# EAGLE design the vert annotated (EAGLE 6.5.0)
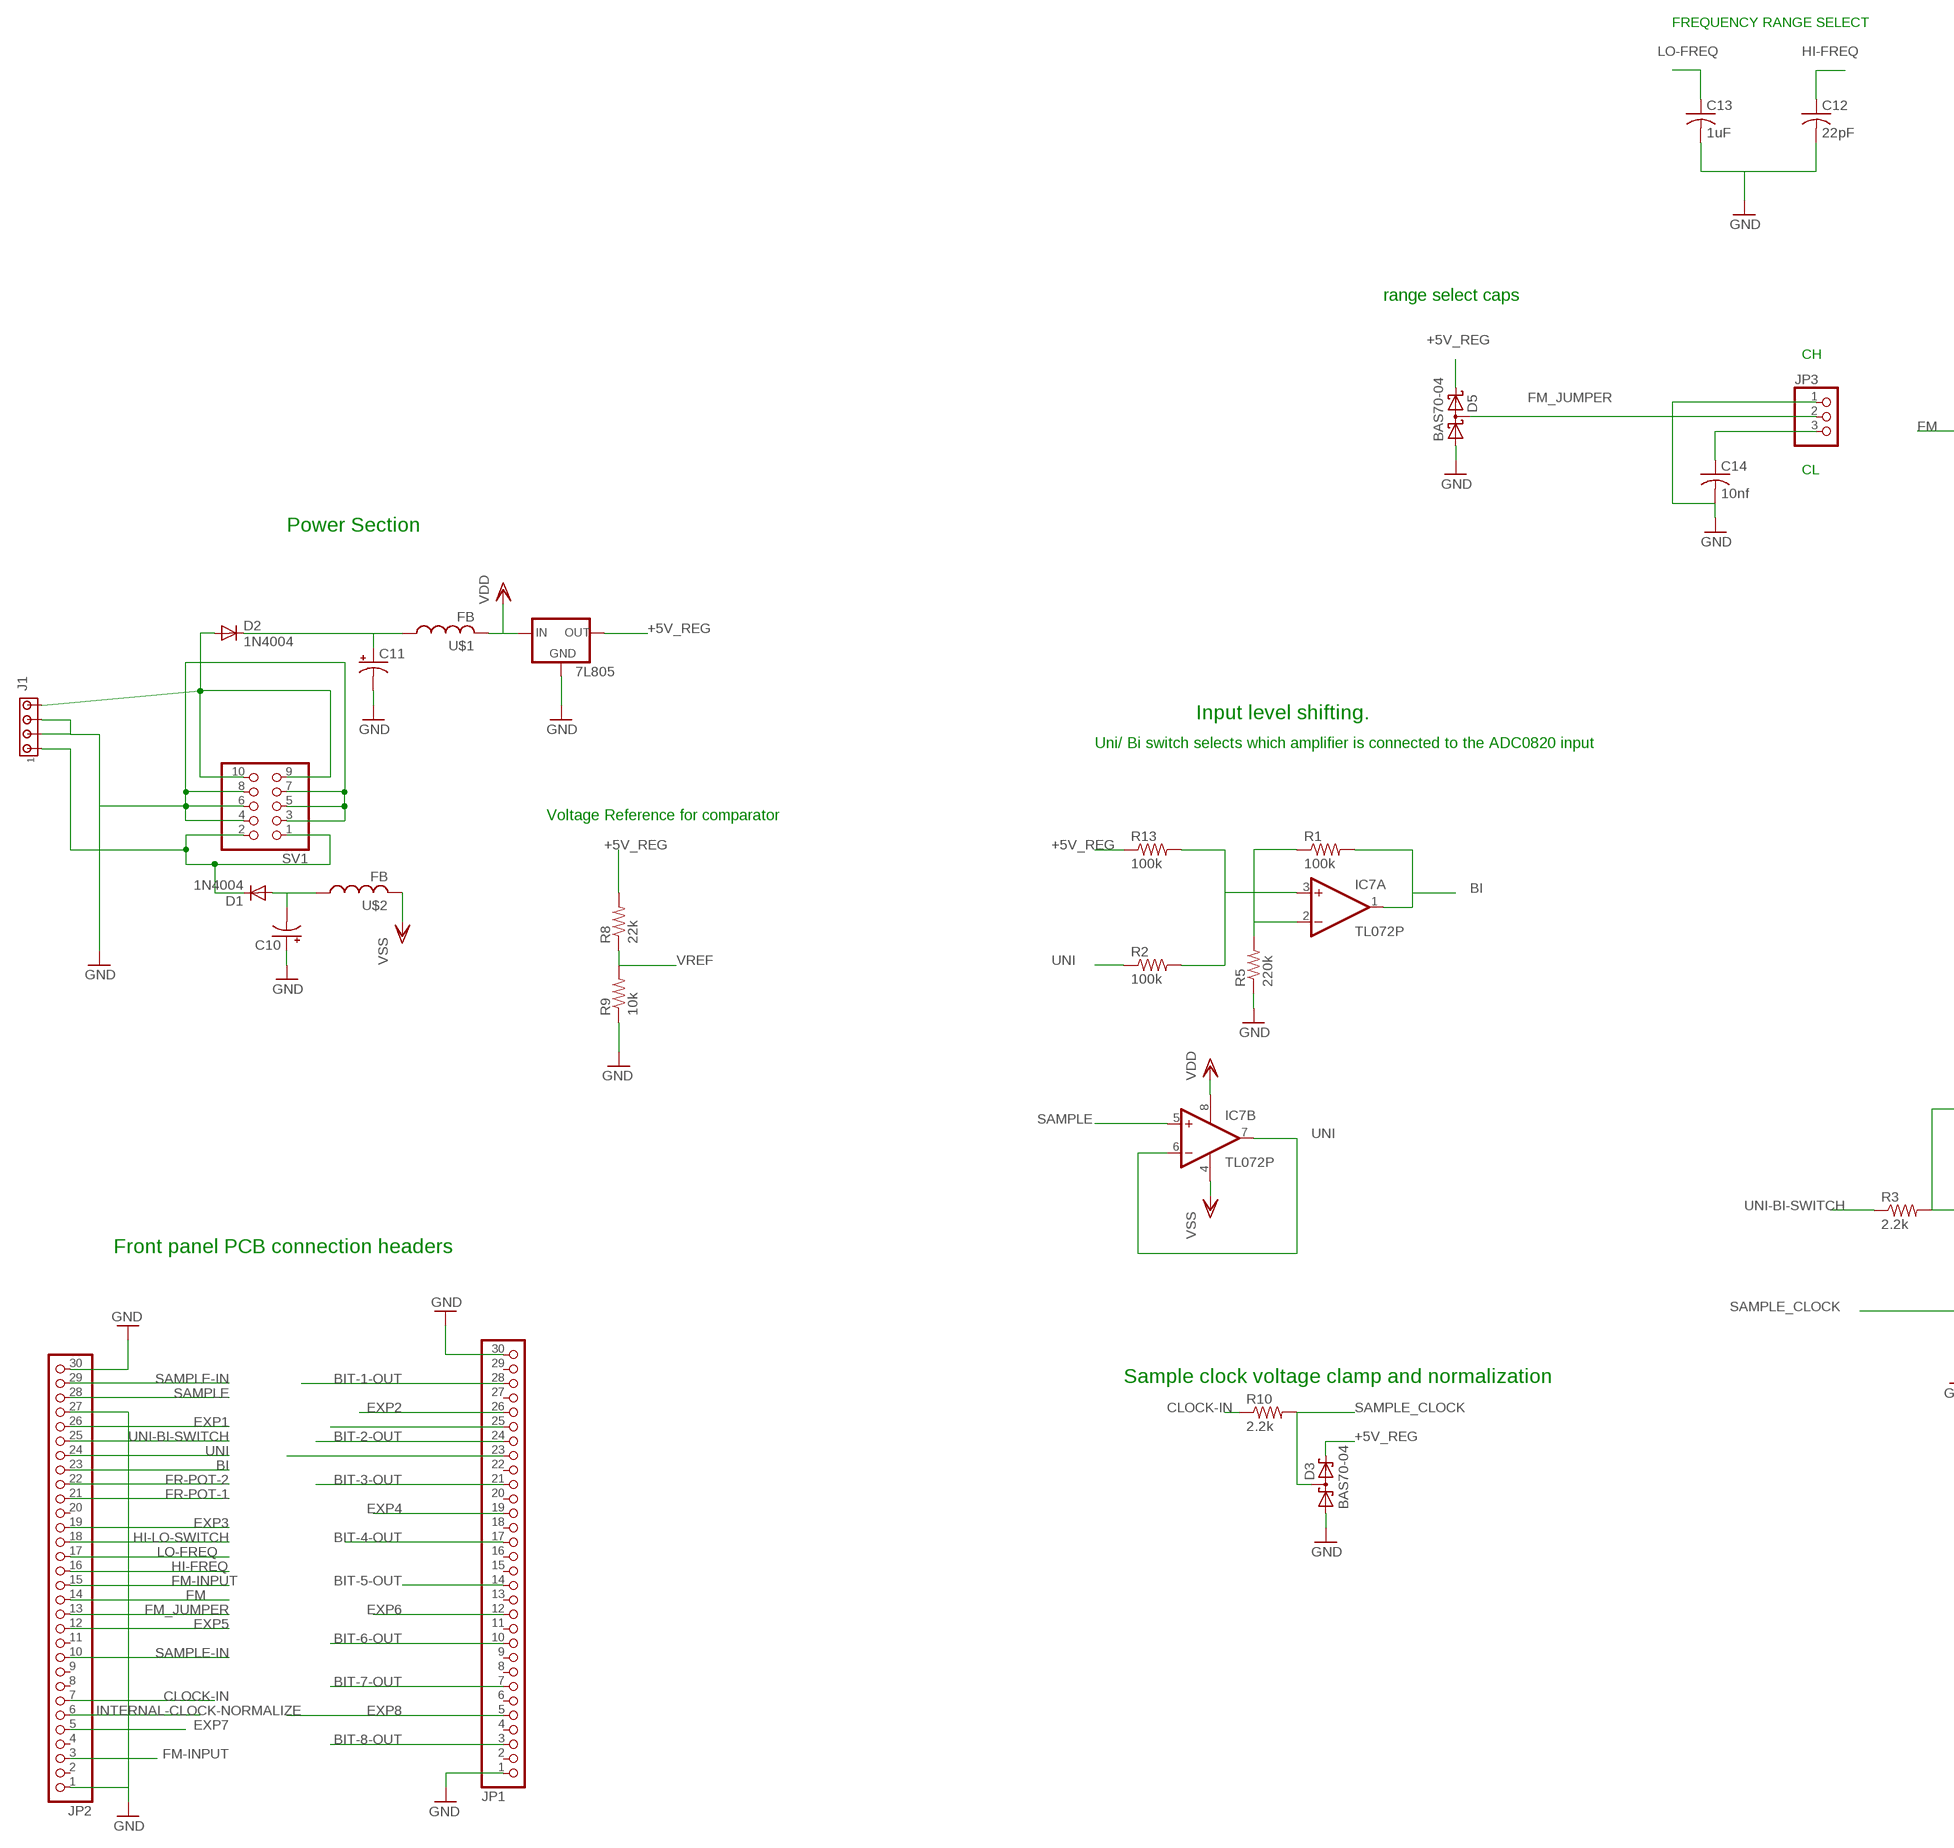
[diagram p0: schematic, sheet 1, part 1 of 2]
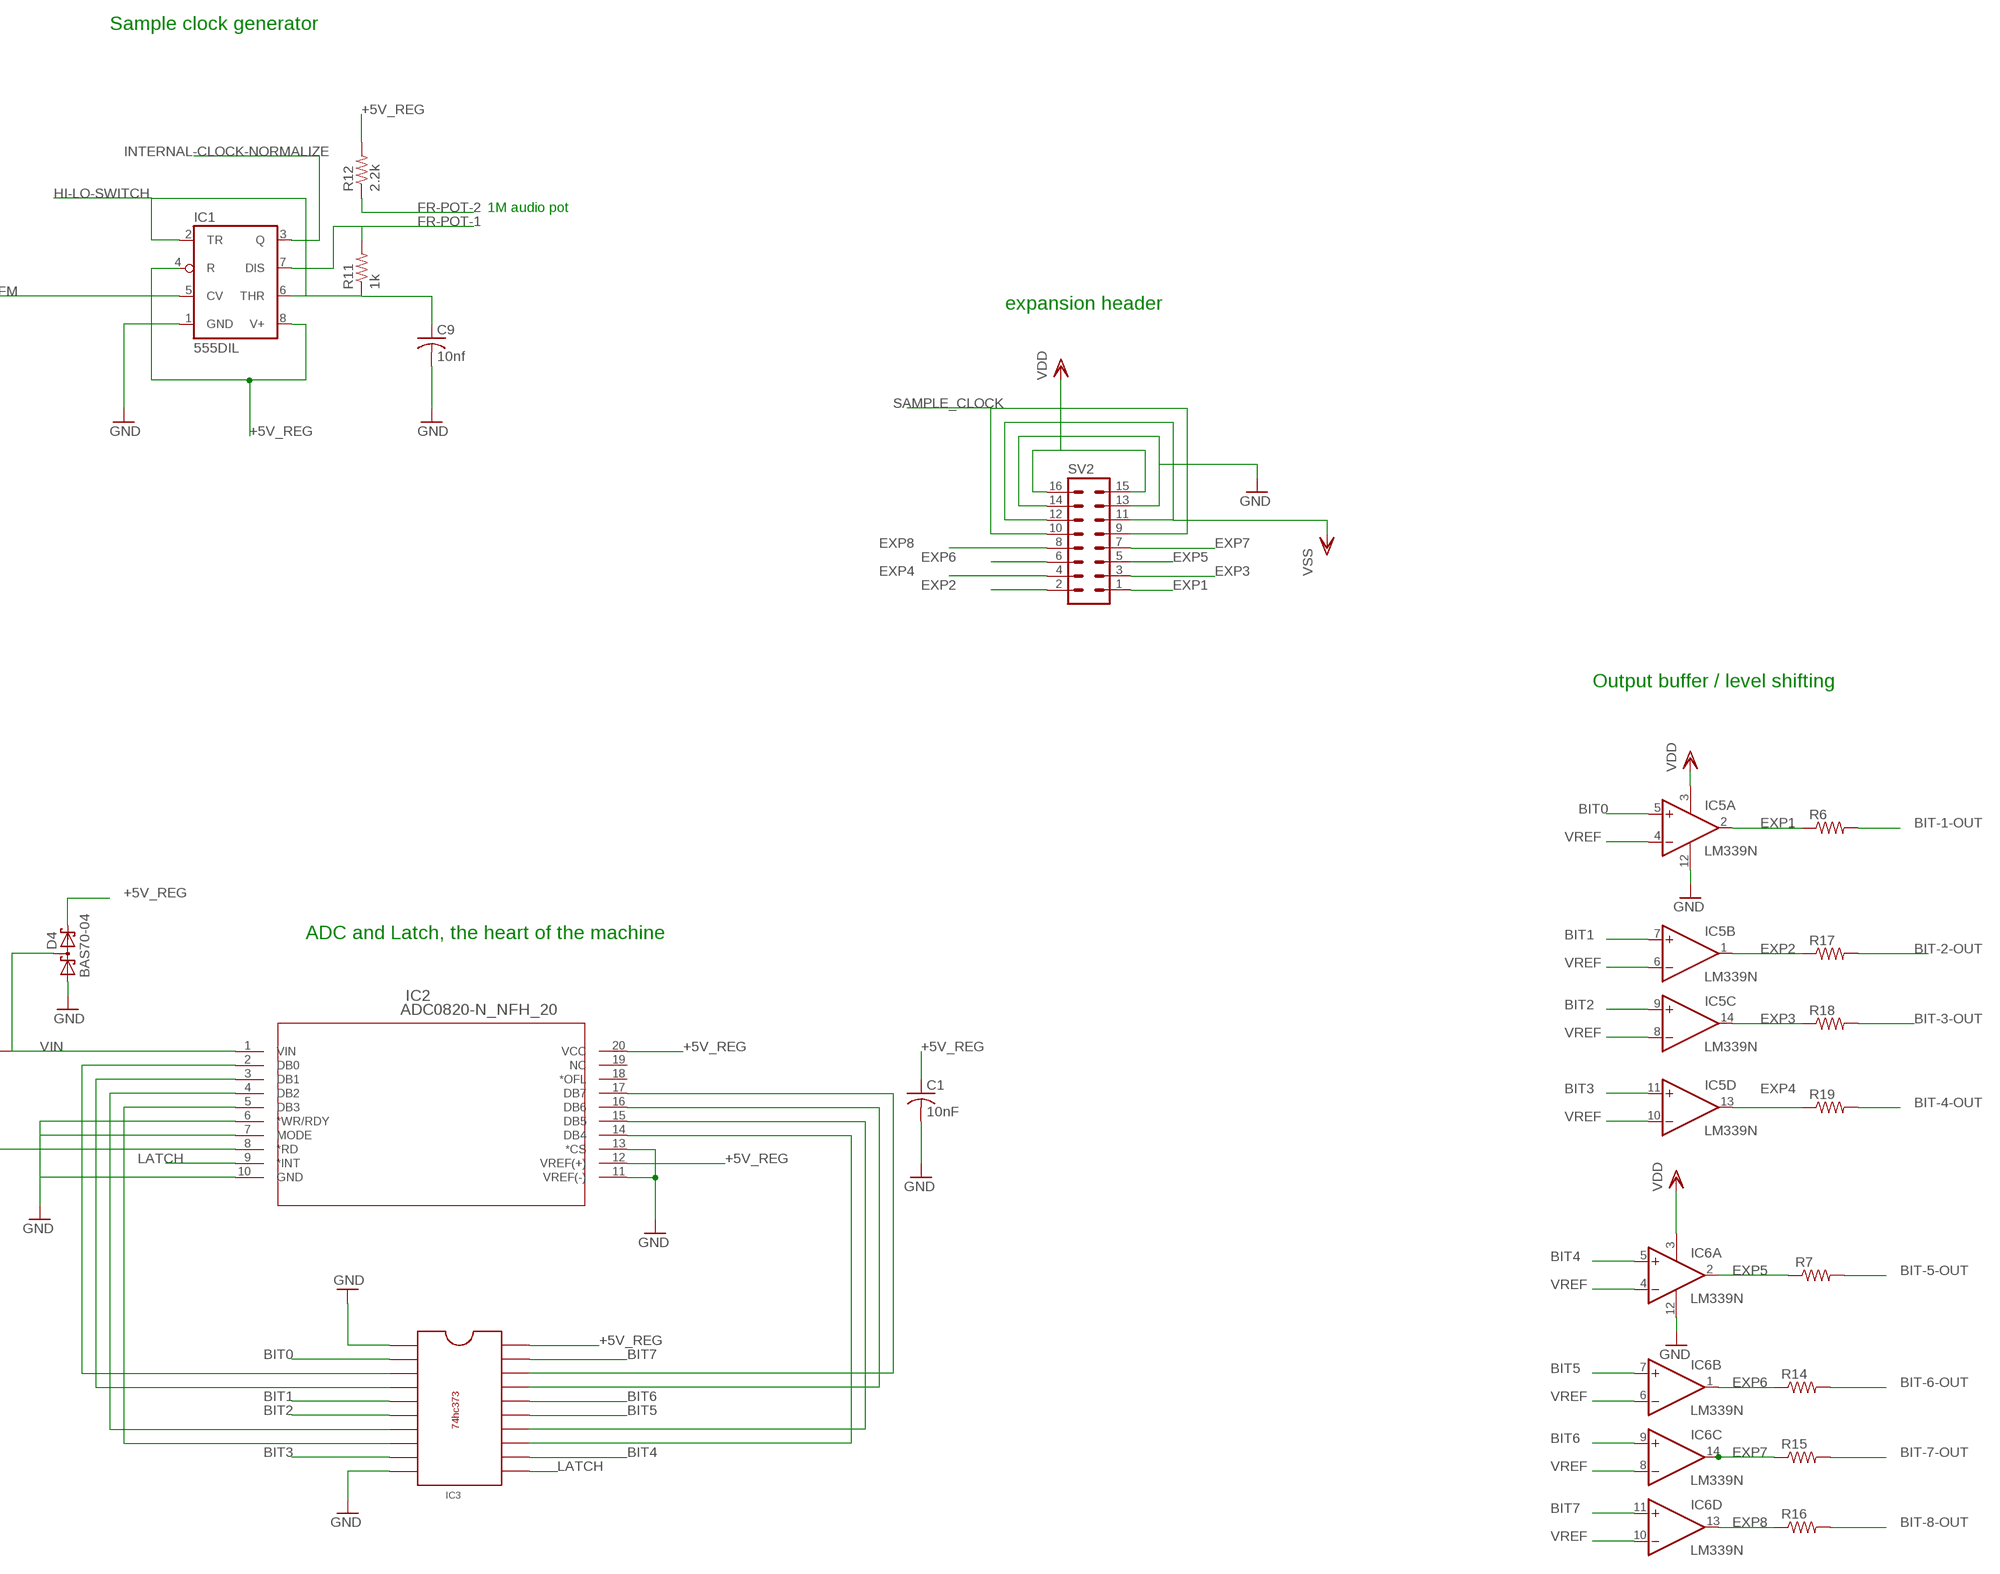
[diagram p1: schematic, sheet 1, part 2 of 2]

## Parts
7L805  78LXX  [78LXX]
C1  10nF  C-USC1206  [C1206]
C9  10nf  C-USC1206  [C1206]
C10  CPOL-USE5-5  [E5-5]
C11  CPOL-USE5-5  [E5-5]
C12  22pF  C-USC1206  [C1206]
C13  1uF  C-USC1206  [C1206]
C14  10nf  C-USC1206  [C1206]
D1  1N4004  [DO41-10]
D2  1N4004  [DO41-10]
D3  BAS70-04  [SOT23]
D4  BAS70-04  [SOT23]
D5  BAS70-04  [SOT23]
IC1  555DIL  [DIL08]
IC2  ADC0820-N_NFH_20  [NFH20]
IC3  74HC373  [DIL20]
IC5  LM339N  [DIL14]
IC6  LM339N  [DIL14]
IC7  TL072P  [DIL08]
J1  MTA04-156  [1X4MTA]
JP1  PINHD-1X30  [1X30]
JP2  PINHD-1X30  [1X30]
JP3  PINHD-1X3  [1X03]
R1  100k  R-US_R1206  [R1206]
R2  100k  R-US_R1206  [R1206]
R3  2.2k  R-US_R1206  [R1206]
R5  220k  R-US_R1206  [R1206]
R6  R-US_R1206  [R1206]
R7  R-US_R1206  [R1206]
R8  22k  R-US_R1206  [R1206]
R9  10k  R-US_R1206  [R1206]
R10  2.2k  R-US_R1206  [R1206]
R11  1k  R-US_R1206  [R1206]
R12  2.2k  R-US_R1206  [R1206]
R13  100k  R-US_R1206  [R1206]
R14  R-US_R1206  [R1206]
R15  R-US_R1206  [R1206]
R16  R-US_R1206  [R1206]
R17  R-US_R1206  [R1206]
R18  R-US_R1206  [R1206]
R19  R-US_R1206  [R1206]
SV1  PINHD-2X5  [2X05]
SV2  MA08-2  [MA08-2]
U$1  FB  [FB]
U$2  FB  [FB]

## Nets
+5V_REG: 7L805.OUT C1.1 D3.2(C2) D4.2(C2) D5.2(C2) IC1.4(R) IC1.8(V+) IC2.12(VREF(+)) IC2.20(VCC) IC3.20 R8.2 R12.2 R13.1
BI: IC7.1(A:OUT) JP2.23 R1.2
BIT0: IC3.2 IC5.5(A:+IN)
BIT1: IC3.5 IC5.7(B:+IN)
BIT2: IC3.6 IC5.9(C:+IN)
BIT3: IC3.9 IC5.11(D:+IN)
BIT4: IC3.12 IC6.5(A:+IN)
BIT5: IC3.15 IC6.7(B:+IN)
BIT6: IC3.16 IC6.9(C:+IN)
BIT7: IC3.19 IC6.11(D:+IN)
BIT-1-OUT: JP1.28 R6.2
BIT-2-OUT: JP1.24 R17.2
BIT-3-OUT: JP1.21 R18.2
BIT-4-OUT: JP1.17 R19.2
BIT-5-OUT: JP1.14 R7.2
BIT-6-OUT: JP1.10 R14.2
BIT-7-OUT: JP1.7 R15.2
BIT-8-OUT: JP1.3 R16.2
CLOCK-IN: JP2.7 R10.1
EXP1: IC5.2(A:OUT) JP2.26 R6.1 SV2.1
EXP2: IC5.1(B:OUT) JP1.26 R17.1 SV2.2
EXP3: IC5.14(C:OUT) JP2.19 R18.1 SV2.3
EXP4: IC5.13(D:OUT) JP1.19 R19.1 SV2.4
EXP5: IC6.2(A:OUT) JP2.12 R7.1 SV2.5
EXP6: IC6.1(B:OUT) JP1.12 R14.1 SV2.6
EXP7: IC6.14(C:OUT) JP2.5 R15.1 SV2.7
EXP8: IC6.13(D:OUT) JP1.5 R16.1 SV2.8
FM: IC1.5(CV) JP2.14
FM-INPUT: JP2.3 JP2.15
FM_JUMPER: D5.3(C1A2) JP2.13 JP3.2
FR-POT-1: IC1.7(DIS) JP2.21 R11.2
FR-POT-2: JP2.22 R12.1
GND: 7L805.GND C1.2 C9.2 C10.+ C11.- C12.2 C13.2 C14.2 D3.1(A1) D4.1(A1) D5.1(A1) IC1.1(GND) IC2.6(*WR/RDY) IC2.7(MODE) IC2.10(GND) IC2.11(VREF(-)) IC2.13(*CS) IC3.1 IC3.10 IC5.12(P:GND) IC6.12(P:GND) J1.2 J1.3 JP1.1 JP1.30 JP2.1 JP2.27 JP2.30 JP3.1 R5.1 R9.1 SV1.3 SV1.4 SV1.5 SV1.6 SV1.7 SV1.8 SV2.13 SV2.14
HI-FREQ: C12.1 JP2.16
HI-LO-SWITCH: C9.1 IC1.2(TR) IC1.6(THR) JP2.18 R11.1
INTERNAL-CLOCK-NORMALIZE: IC1.3(Q) JP2.6
LATCH: IC2.9(*INT) IC3.11
LO-FREQ: C13.1 JP2.17
N$2: D2.A J1.4 SV1.9 SV1.10
N$3: C14.1 JP3.3
N$5: IC7.2(A:-IN) R1.1 R5.2
N$8: D1.C J1.1 SV1.1 SV1.2
N$10: C11.+ D2.C U$1.P$1
N$11: IC2.2(DB0) IC3.3
N$12: C10.- D1.A U$2.P$1
N$13: IC7.3(A:+IN) R2.2 R13.2
N$15: IC2.3(DB1) IC3.4
N$16: IC2.4(DB2) IC3.7
N$17: IC2.5(DB3) IC3.8
N$18: IC2.17(DB7) IC3.18
N$19: IC2.16(DB6) IC3.17
N$20: IC2.15(DB5) IC3.14
N$21: IC2.14(DB4) IC3.13
R-NC-2: JP1.25
R-SW-2: JP1.23
SAMPLE: IC7.5(B:+IN) JP2.28
SAMPLE-IN: JP2.10 JP2.29
SAMPLE_CLOCK: D3.3(C1A2) IC2.8(*RD) R10.2 SV2.9 SV2.10
UNI: IC7.6(B:-IN) IC7.7(B:OUT) JP2.24 R2.1
UNI-BI-SWITCH: JP2.25 R3.1
VDD: 7L805.IN IC5.3(P:V+) IC6.3(P:V+) IC7.8(P:V+) SV2.15 SV2.16 U$1.P$2
VIN: D4.3(C1A2) IC2.1(VIN) R3.2
VREF: IC5.4(A:-IN) IC5.6(B:-IN) IC5.8(C:-IN) IC5.10(D:-IN) IC6.4(A:-IN) IC6.6(B:-IN) IC6.8(C:-IN) IC6.10(D:-IN) R8.1 R9.2
VSS: IC7.4(P:V-) SV2.11 SV2.12 U$2.P$2
Unconnected: IC2.18(*OFL) IC2.19(NC) JP1.2 JP1.4 JP1.6 JP1.8 JP1.9 JP1.11 JP1.13 JP1.15 JP1.16 JP1.18 JP1.20 JP1.22 JP1.27 JP1.29 JP2.2 JP2.4 JP2.8 JP2.9 JP2.11 JP2.20

## Notes on the sheet
- FREQUENCY RANGE SELECT
- Sample clock generator
- range select caps
- 1M audio pot
- CH
- expansion header
- CL
- Power Section
- Input level shifting.
- Uni/ Bi switch selects which amplifier is connected to the ADC0820 input
- Voltage Reference for comparator
- Output buffer / level shifting
- ADC and Latch, the heart of the machine
- Front panel PCB connection headers
- Sample clock voltage clamp and normalization

## Library data of the parts
7L805 = v-reg:78LXX: VOLTAGE REGULATOR
C1 C9 C12-C14 = adafruit:C-US: CAPACITOR, American symbol
C10 C11 = resistor:CPOL-US: POLARIZED CAPACITOR, American symbol
D1 D2 = diode:1N4004: DIODE general purpose rectifier, 1 A
D3-D5 = diode:BAS70-04: Silicon Schottky Diodes General-purpose diode for high-speed switching
IC1 = adafruit:*555: TIMER Changed DIP package to have round (not oval) pin pads http://www.ladyada.net/library/pcb/eaglelibrary.html
IC2 = adc0820:ADC0820-N_NFH_20; MANUFACTURER_PART_NUMBER: adc0820_dw_20; VENDOR: Texas Instruments
IC3 = elipech_modified:74HC373
IC5 IC6 = linear:LM339: Low Power Low Offset Voltage Quad Comparators with open collector; LM139/LM239/LM339/LM2901/LM3302
IC7 = linear:TL072: OP AMP
J1 = con-amp:MTA04-156: AMP connector
JP1 JP2 = pinhead:PINHD-1X30: PIN HEADER
JP3 = adafruit:PINHD-1X3: PIN HEADER
R1-R3 R5-R19 = adafruit:R-US_: RESISTOR, American symbol
SV1 = pinhead:PINHD-2X5: PIN HEADER
SV2 = con-lstb:MA08-2: PIN HEADER; OC_FARNELL: unknown; OC_NEWARK: unknown
U$1 U$2 = adafruit:FB: Ferrite bead Digikey #P9821BK-ND

## Board
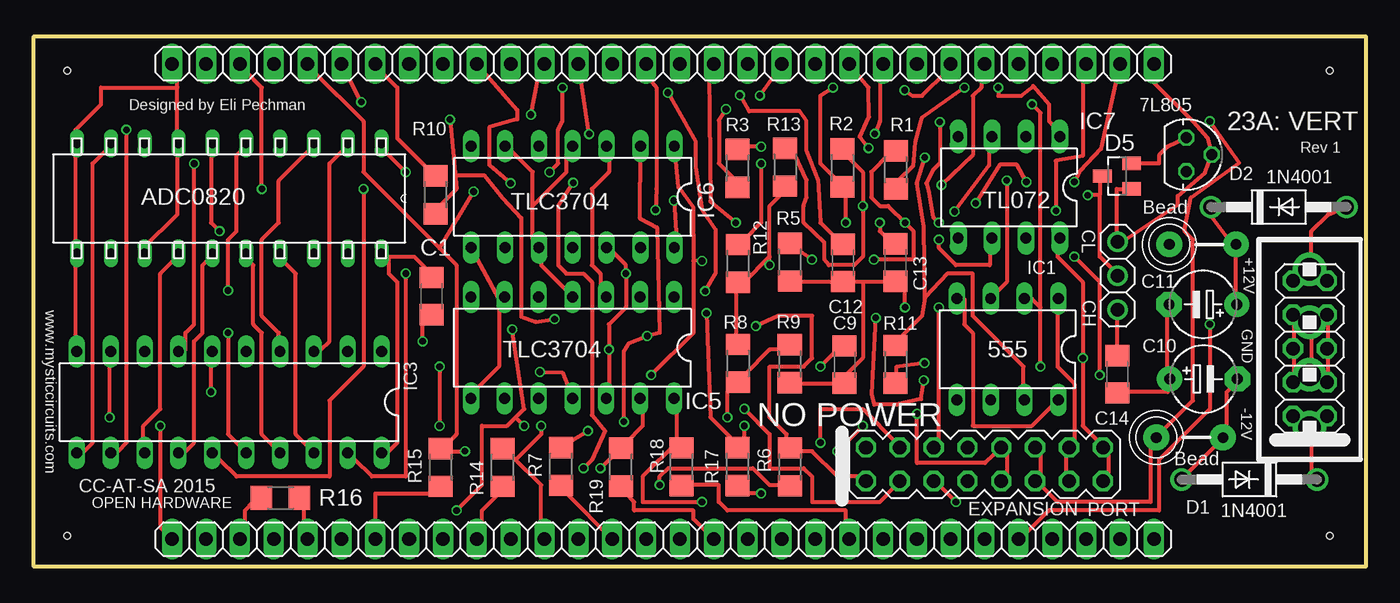
[diagram p2: board, top side]
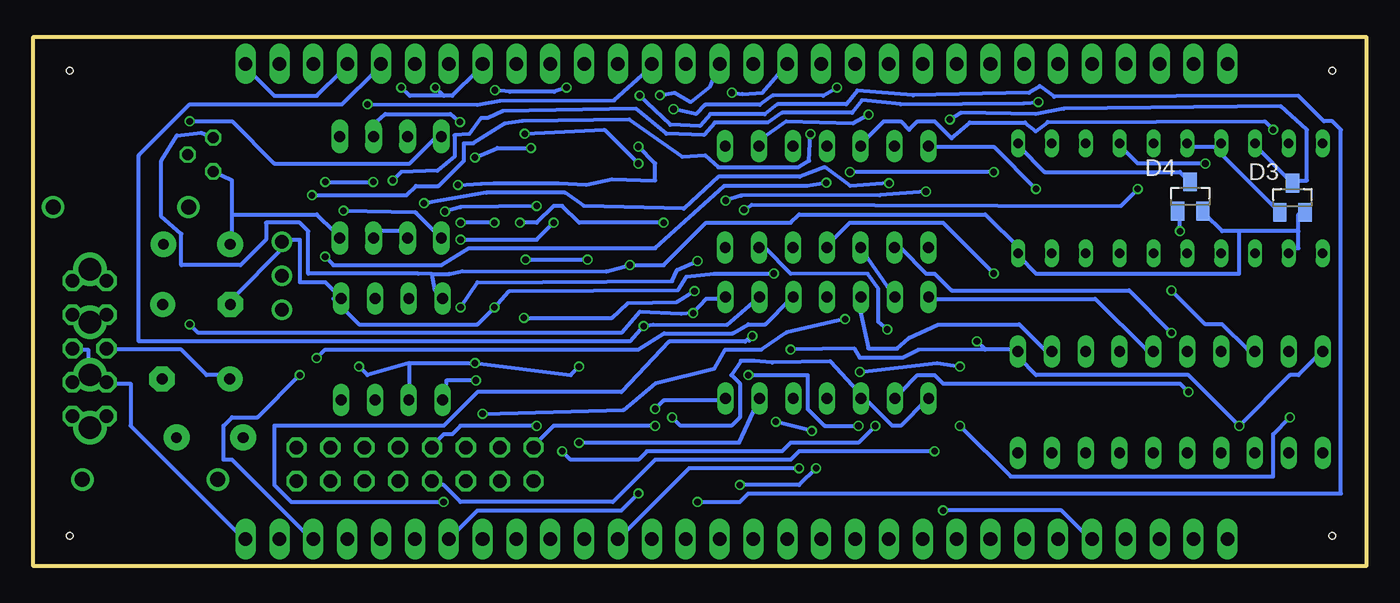
[diagram p3: board, bottom side, seen from below]

Size 100 x 39.75 mm. Coordinates in mm from the lower left corner, seen from the top.
Outline: 0,0 100,0 100,39.75 0,39.75 0,0
Copper layers (1*16): Top 0.035mm / dielectric 1.5mm / Bottom 0.035mm
Design rules "default *": minimum track width 12mil, minimum drill 24mil, track to track 12mil, track to pad 8mil, pad to pad 8mil, via to via 8mil, smd to smd 8mil, copper to edge 40mil, drill to drill 10mil, minimum pad ring 0mil, minimum via ring 0mil, stop-mask expansion 4mil, vias tented up to drill 20mil, thermal gap 10mil
Holes 0.5 mm at 2.54,37.21 2.54,2.29 97.28,2.29 97.28,37.21

### Footprints (pad centres in the part's own frame; a part is rotated, then mirrored left to right if it is on the bottom)
78LXX = drill 0.813 octagon: GND 0,1.905; IN 1.27,0; OUT -1.27,0
C1206 = smd 1.6 x 1.8: 1 -1.4,0; 2 1.4,0
E5-5 = drill 0.813 pad 1.905: + -2.54,0 | drill 0.813 pad 1.905 octagon: - 2.54,0
DO41-10 = drill 1.118: A 5.08,0; C -5.08,0
SOT23 = smd 1 x 1.4: 1 -0.95,-1.1; 2 0.95,-1.1; 3 0,1.1
DIL08 = drill 0.813 long: 1 -3.81,-3.81; 2 -1.27,-3.81; 3 1.27,-3.81; 4 3.81,-3.81; 5 3.81,3.81; 6 1.27,3.81; 7 -1.27,3.81; 8 -3.81,3.81
NFH20 = drill 0.711 long: 1 -8.255,22.86; 2 -8.255,20.32; 3 -8.255,17.78; 4 -8.255,15.24; 5 -8.255,12.7; 6 -8.255,10.16; 7 -8.255,7.62; 8 -8.255,5.08; 9 -8.255,2.54; 10 -8.255,0; 11 0,0; 12 0,2.54; 13 0,5.08; 14 0,7.62; 15 0,10.16; 16 0,12.7; 17 0,15.24; 18 0,17.78; 19 0,20.32; 20 0,22.86
DIL20 = drill 0.813 long: 1 -11.43,-3.81; 2 -8.89,-3.81; 3 -6.35,-3.81; 4 -3.81,-3.81; 5 -1.27,-3.81; 6 1.27,-3.81; 7 3.81,-3.81; 8 6.35,-3.81; 9 8.89,-3.81; 10 11.43,-3.81; 11 11.43,3.81; 12 8.89,3.81; 13 6.35,3.81; 14 3.81,3.81; 15 1.27,3.81; 16 -1.27,3.81; 17 -3.81,3.81; 18 -6.35,3.81; 19 -8.89,3.81; 20 -11.43,3.81
DIL14 = drill 0.813 long: 1 -7.62,-3.81; 2 -5.08,-3.81; 3 -2.54,-3.81; 4 0,-3.81; 5 2.54,-3.81; 6 5.08,-3.81; 7 7.62,-3.81; 8 7.62,3.81; 9 5.08,3.81; 10 2.54,3.81; 11 0,3.81; 12 -2.54,3.81; 13 -5.08,3.81; 14 -7.62,3.81
DIL08' = drill 0.813 pad 1.27 long: 1 -3.81,-3.81; 2 -1.27,-3.81; 3 1.27,-3.81; 4 3.81,-3.81; 5 3.81,3.81; 6 1.27,3.81; 7 -1.27,3.81; 8 -3.81,3.81
1X4MTA = drill 1.676: 1 5.944,0; 2 1.981,0; 3 -1.981,0; 4 -5.944,0
1X30 = drill 1.016 long: 1 -36.83,0; 2 -34.29,0; 3 -31.75,0; 4 -29.21,0; 5 -26.67,0; 6 -24.13,0; 7 -21.59,0; 8 -19.05,0; 9 -16.51,0; 10 -13.97,0; 11 -11.43,0; 12 -8.89,0; 13 -6.35,0; 14 -3.81,0; 15 -1.27,0; 16 1.27,0; 17 3.81,0; 18 6.35,0; 19 8.89,0; 20 11.43,0; 21 13.97,0; 22 16.51,0; 23 19.05,0; 24 21.59,0; 25 24.13,0; 26 26.67,0; 27 29.21,0; 28 31.75,0; 29 34.29,0; 30 36.83,0
1X03 = drill 1.016: 1 -2.54,0; 2 0,0; 3 2.54,0
R1206 = smd 1.6 x 1.803: 1 -1.422,0; 2 1.422,0
2X05 = drill 1.016 octagon: 1 -5.08,-1.27; 2 -5.08,1.27; 3 -2.54,-1.27; 4 -2.54,1.27; 5 0,-1.27; 6 0,1.27; 7 2.54,-1.27; 8 2.54,1.27; 9 5.08,-1.27; 10 5.08,1.27
MA08-2 = drill 1.016 octagon: 1 -8.89,-1.27; 2 -8.89,1.27; 3 -6.35,-1.27; 4 -6.35,1.27; 5 -3.81,-1.27; 6 -3.81,1.27; 7 -1.27,-1.27; 8 -1.27,1.27; 9 1.27,-1.27; 10 1.27,1.27; 11 3.81,-1.27; 12 3.81,1.27; 13 6.35,-1.27; 14 6.35,1.27; 15 8.89,-1.27; 16 8.89,1.27
FB = drill 0.8 pad 1.93: P$1 -2.5,0; P$2 2.5,0

### Placement (x,y rotation side)
7L805  86.51,30.9 270 top
C1  29.87,20.27 270 top
C9  60.87,15.13 270 top
C10  87.8,14.06 0 top
C11  87.76,19.65 180 top
C12  60.74,22.78 270 top
C13  64.69,22.8 270 top
C14  81.33,14.41 270 top
D1  91.24,6.52 180 top
D2  93.44,26.97 0 top
D3  5.54,27.66 0 bottom
D4  13.21,27.76 0 bottom
D5  81.3,29.29 90 top
IC1  73.1,16.29 180 top
IC2  3.27,23.49 270 top
IC3  14.7,12.32 180 top
IC5  40.45,16.41 180 top
IC6  40.47,27.73 180 top
IC7  TL072P  [DIL08']  73.2,28.45 180 top
J1  95.75,16.35 270 top
JP1  47.24,2.03 0 top
JP2  47.24,37.72 0 top
JP3  81.35,21.8 270 top
R1  64.71,29.75 270 top
R2  60.71,29.91 90 top
R3  52.84,29.87 270 top
R5  56.75,22.83 90 top
R6  56.78,7.46 270 top
R7  39.6,7.49 270 top
R8  52.87,15.23 90 top
R9  56.75,15.21 90 top
R10  30.19,27.89 270 top
R11  64.7,15.16 90 top
R12  52.88,22.73 270 top
R13  56.41,29.95 90 top
R14  35.21,7.42 270 top
R15  30.57,7.42 270 top
R16  18.55,5.13 180 top
R17  52.84,7.49 270 top
R18  48.63,7.47 270 top
R19  44.08,7.44 270 top
SV1  95.78,16.35 90 top
SV2  71.36,7.65 0 top
U$1  87.73,24.16 180 top
U$2  86.75,9.67 180 top

### Tracks (layer width: path | path; a pad name or v marks a point on that pad's centre or on a via)
+5V_REG  (via drill 0.5)
  Top 0.305: 26.67,23.24 26.04,23.24 IC2.20 | 26.67,23.24 28.57,23.24 29.84,21.97 C1.1 | 26.67,23.24 26.67,21.97 27.3,21.34 27.3,9.27 26.67,8.64 IC3.20 | R8.2 52.7,16.89 52.7,20.7 R12.2 53.34,21.34 55.24,23.24 | 55.24,23.24 55.24,27.05 56.52,28.32 R13.1 | D5.2 82.55,30.23 84.45,30.23 84.45,30.86 85.09,31.5 7L805.OUT | IC1.8 76.83,12.45 74.93,10.54 70.48,10.54 70.48,17.53 69.85,18.16 69.85,20.07 IC1.4 | v55.24,22.61 55.24,23.24
  Bottom 0.305: 5.08,25.15 5.08,23.88 5.71,23.88 IC2.12 | 5.08,25.15 5.08,26.42 D3.2 | 5.08,25.15 9.53,25.15 | 9.53,25.15 10.79,25.15 12.06,26.42 D4.2 | 9.53,25.15 9.53,21.97 24.77,21.97 26.04,23.24 IC2.20 26.04,23.88 28.57,26.42 42.55,26.42 43.18,25.78 49.53,25.78 52.7,22.61 v55.24,22.61 57.02,22.14 67.8,22.15 68.8,21.95 70.08,21.94 | 70.08,21.94 69.85,20.7 IC1.4 | 70.08,21.94 71.12,21.97 79.38,21.97 79.38,25.15 80.01,25.78 82.55,25.78 82.55,24.51 84.45,22.61 88.9,22.61 88.9,24.95 90.4,26.25 90.4,30.46 89.23,32.33 87.42,32.53 7L805.OUT
BI  (via drill 0.5)
  Top 0.305: v69.85,35.94 66.64,33.64 66.14,31.83 66,30.05 64.87,28.96 R1.2 | v72.39,35.94 72.39,35.31 74.09,35.31 75.03,36.04 76.2,34.67 76.2,33.4 76.83,32.77 IC7.1
  Bottom 0.305: 69.22,35.31 v69.85,35.94 | 69.22,35.31 68.58,35.31 66.67,37.21 JP2.23 | v72.39,35.94 71.75,35.31 69.22,35.31
BIT0
  Bottom 0.305: IC3.2 24.13,16.26 26.04,18.16 29.9,18.15 32.1,18.15 34.3,17.15 35.2,16.35 37.36,16.36 38.06,19.57 IC5.5
BIT1
  Bottom 0.305: IC3.5 16.51,16.26 20.32,20.07 32.38,20.07 IC5.7
BIT2  (via drill 0.5)
  Top 0.305: v13.34,13.08 13.34,15.62 IC3.6
  Bottom 0.305: v13.34,13.08 13.97,13.72 31.75,13.72 32.38,14.35 33.66,14.35 34.92,13.08 IC5.9
BIT3  (via drill 0.5)
  Top 0.305: v5.71,11.18 5.71,15.62 IC3.9 | v30.48,14.99 v30.48,10.54 | v38,14.59 39.7,14.55 IC5.11
  Bottom 0.305: v5.71,11.18 6.99,9.91 6.99,6.73 26.67,6.73 v30.48,10.54 | v38,14.59 32.2,15.25 v30.48,14.99
BIT4  (via drill 0.5)
  Top 0.305: v6.99,32.77 6.99,9.27 6.35,8.64 IC3.12
  Bottom 0.305: v6.99,32.77 7.62,33.4 23.9,33.35 24.8,32.65 25.6,33.3 29.75,33.3 31.11,32.13 32.38,33.4 33.66,33.4 34.29,32.77 34.92,33.4 36.2,33.4 37.47,32.13 IC6.5
BIT5  (via drill 0.5)
  Top 0.305: v24.77,28.32 24.77,14.99 22.23,12.45 22.23,6.73 15.24,6.73 13.97,8 IC3.15
  Bottom 0.305: v24.77,28.32 27.94,31.5 32.38,31.5 IC6.7
BIT6  (via drill 0.5)
  Top 0.305: v14.61,17.53 14.61,9.91 15.88,8.64 IC3.16
  Bottom 0.305: v14.61,17.53 17.78,20.7 31.11,20.7 32.38,21.97 33.02,21.97 34.92,23.88 IC6.9
BIT7  (via drill 0.5)
  Top 0.305: v27.94,21.97 27.94,6.73 25.4,6.73 24.13,8 IC3.19
  Bottom 0.305: v27.94,21.97 31.75,25.78 38.73,25.78 40.01,24.51 IC6.11
BIT-1-OUT  (via drill 0.5)
  Top 0.305: v46.99,6.1 46.99,6.73 47.62,7.37 53.98,7.37 55.24,6.1 56.52,6.1 R6.2 | v41.27,7.37 41.91,8 42.9,10.15 41.9,11.35 41.91,21.34 41.27,21.97 40.01,21.97 39.37,22.61 39.37,27.05 v40.51,28.79 | v78.11,23.24 80.01,21.34 v80.01,14.35
  Bottom 0.305: v46.99,6.1 42.55,6.1 v41.27,7.37 | v40.51,28.79 41.95,28.56 48.16,28.56 53.34,23.88 67.31,23.88 69.38,22.61 77.47,22.61 v78.11,23.24 | v80.01,14.35 83.19,11.18 85.09,11.18 85.72,10.54 85.72,8 85.09,8 79.38,2.29 JP1.28
BIT-2-OUT  (via drill 0.5)
  Top 0.305: v54.61,5.46 53.34,5.46 R17.2
  Bottom 0.305: v54.61,5.46 55.88,4.19 66.67,4.19 JP1.24
BIT-3-OUT
  Top 0.305: R18.2 48.9,6.1 51.44,6.1 51.44,4.83 52.07,4.19 60.96,4.19 60.96,2.29 JP1.21
BIT-4-OUT
  Top 0.305: JP1.17 49.53,3.56 49.53,4.19 45.09,4.19 45.09,4.83 44.45,5.46 R19.2
BIT-5-OUT
  Top 0.305: JP1.14 40.01,5.46 R7.2
BIT-6-OUT
  Top 0.305: R14.2 34.92,5.46 33.66,4.19 33.66,2.29 JP1.10
BIT-7-OUT
  Top 0.305: R15.2 30.48,5.46 25.65,5.46 JP1.7
BIT-8-OUT
  Top 0.305: R16.2 16.51,4.83 15.88,4.19 15.88,2.29 JP1.3
CLOCK-IN
  Top 0.305: R10.1 29.84,29.59 27.3,32.13 27.3,35.94 26.04,37.21 JP2.7
EXP1  (via drill 0.5)
  Top 0.305: SV2.1 62.23,6.73 60.33,6.73 58.42,8.64 57.15,8.64 R6.1 56.52,9.27 56.52,9.91 55.24,11.18 55.24,14.99 57.78,14.99 58.42,15.62 58.42,18.8 55.88,18.8 v54.21,18.03
  Bottom 0.305: IC5.2 45.72,20.07 47.96,18.13 53.5,18.15 v54.21,18.03 55.24,16.89 92.08,16.89 92.08,30.86 88.27,34.67 76.83,34.67 74.3,37.21 JP2.26
EXP2  (via drill 0.5)
  Top 0.305: v50.5,19 50.8,11.18 52.7,9.27 R17.1 53.34,9.27 v53.34,10.54 | v88.27,18.16 88.27,11.81 84.45,8 84.45,4.19 76.2,4.19 74.3,2.29 JP1.26
  Bottom 0.305: IC5.1 48.26,20.07 49.53,20.07 v50.5,19 51.4,18.95 54.51,19.1 55.88,17.53 87.63,17.53 v88.27,18.16 | v53.34,10.54 60.96,10.54 62.23,9.27 SV2.2
EXP3  (via drill 0.5)
  Top 0.305: 48.26,9.27 48.26,12.45 IC5.14 | v53.34,11.81 55.24,9.91 55.24,7.37 57.78,7.37 58.42,6.73 58.42,4.83 63.5,4.83 64.77,6.1 SV2.3 | v54.51,35.34 55.88,37.21 JP2.19 | v50.16,4.83 45.72,4.83 45.72,6.73 48.26,9.27 | 48.26,9.27 R18.1
  Bottom 0.305: v53.34,11.81 52.7,12.45 48.26,12.45 IC5.14 | v54.51,35.34 52.2,33.15 50,33.05 49.2,33.95 45.12,33.94 44.19,34.67 39.01,34.67 38.17,35.71 34,35.35 25.3,35.55 24.5,36.05 23.4,35.25 5.08,35.31 3.17,33.4 2.54,33.4 1.91,32.77 1.91,5.46 46.35,5.46 46.99,4.83 v50.16,4.83
EXP4  (via drill 0.5)
  Top 0.305: IC5.13 45.72,12.45 45.72,10.54 44.45,9.27 R19.1 43.81,8.64 v42.55,7.37 | v59.05,9.27 59.05,11.81 62.23,11.81 64.77,9.27 SV2.4
  Bottom 0.305: JP1.19 50.8,7.37 v42.55,7.37 | v59.05,9.27 47.05,9.27 IC5.13
EXP5  (via drill 0.5)
  Top 0.305: 39.37,9.27 R7.1 v41.6,10.15 | IC6.2 45.52,26.1 46.79,25.43 46.99,17.53 v46.05,17.29 44.7,16.75 44.3,16.15 v44.3,10.85 | v69.22,4.83 67.94,6.1 SV2.5 | v37.34,33.9 37.84,36.41 JP2.12
  Bottom 0.305: v69.22,4.83 80.64,4.83 81.92,6.1 81.92,10.54 69.22,10.54 66.67,13.08 55.88,13.08 52.3,16.86 46.59,16.86 v46.05,17.29 46.3,16.95 | v37.34,33.9 38.5,33.25 43.52,33.4 45.48,32.03 IC6.2 | v41.6,10.15 v44.3,10.85
EXP6  (via drill 0.5)
  Top 0.305: 36.2,8 38.1,6.1 38.1,2.29 JP1.12 | 36.2,8 35.56,8.64 R14.1 | v67.94,19.43 67.94,9.27 SV2.6 | 36.2,8 38.1,9.91 v38.1,10.54 | v46.35,14.35 49.53,17.53 49.53,22.95 | 49.53,22.95 49.5,26.95 48.4,28.45 IC6.1 | v50.16,22.91 49.53,22.95
  Bottom 0.305: v50.16,22.91 51.7,22.25 52.07,21.4 66.67,21.3 v67.94,19.43 | v38.1,10.54 40.64,10.54 41.91,11.81 41.91,14.35 v46.35,14.35
EXP7  (via drill 0.5)
  Top 0.305: 30.48,23.88 24.77,29.59 24.77,33.4 20.95,37.21 JP2.5 | 30.48,23.88 31.75,22.61 31.75,9.91 31.11,9.27 R15.1 31.11,8.64 v32.38,8.64 | v48.06,27.45 48.26,24.51 IC6.14 | 30.48,23.88 v33.02,28.12
  Bottom 0.305: v48.06,27.45 46.89,27.82 36.5,27.85 v33.02,28.12 | v32.38,8.64 42.55,8.64 43.18,8 53.34,8 56.52,4.83 67.94,4.83 69.22,6.1 69.85,6.1 SV2.7
EXP8  (via drill 0.5)
  Top 0.305: R16.1 20.32,4.83 20.32,2.29 JP1.5 | v35.93,17.77 36.83,11.81 36.2,11.18 | 36.2,11.18 35.56,10.54 33.66,10.54 33.66,6.1 v31.75,4.19 | v60.33,8.64 v62.23,10.54 | 36.2,11.18 v36.83,10.54
  Bottom 0.305: v35.93,17.77 36.6,18.35 36.6,20.85 37.4,21.95 43.18,21.97 45.09,23.88 IC6.13 | v31.75,4.19 22.86,4.19 20.95,2.29 JP1.5 | v62.23,10.54 67.94,10.54 68.58,9.91 69.22,9.91 69.85,9.27 SV2.8 | v60.33,8.64 59.69,8 54.61,8 53.98,8.64 43.81,8.64 43.18,9.27 38.1,9.27 v36.83,10.54
FM  (via drill 0.5)
  Top 0.305: v63.2,18.65 62.9,12.95 63.1,12.15 64.8,12.15 66.6,12.55 v66.8,13.95 | v50.4,20.65 51.2,22.05 51.2,25.25 50.2,26.75 49.7,29.95 49.7,31.85 v47.6,35.55
  Bottom 0.305: v63.2,18.65 56.6,18.65 55.4,19.75 51.7,19.85 v50.4,20.65 | v47.6,35.55 46.8,35.45 45.3,35.55 JP2.14 | v66.8,13.95 69,13.95 IC1.5
FM-INPUT  (via drill 0.5)
  Top 0.305: v17.14,28.32 17.14,35.94 15.88,37.21 JP2.3 | v46.68,26.75 46.75,28.32 46.75,35.94 45.72,37.21 JP2.15
  Bottom 0.305: v17.14,28.32 18.41,27.05 46.1,27.15 v46.68,26.75
FM_JUMPER  (via drill 0.5)
  Top 0.305: 80.01,27.86 80.01,23.24 81.28,21.97 JP3.2 | D5.3 80.01,28.96 80.01,27.86 | 80.01,27.86 80,27.85 v79.1,27.85 | v41.7,32.45 JP2.13
  Bottom 0.305: v79.1,27.85 72,27.85 71.3,28.55 69.6,28.55 67.7,30.45 67.7,31.75 67,31.75 64.6,33.25 63.3,33.45 55.3,33.55 51.3,30.75 49.6,30.85 48.6,29.95 42.6,29.95 41.8,30.45 v41.7,32.45
FR-POT-1  (via drill 0.5)
  Top 0.305: 66.88,20.17 66.67,18.8 64.77,16.89 R11.2 | 66.88,20.17 68.58,21.97 70.48,21.97 70.48,18.8 74.3,14.99 74.3,13.08 IC1.7 | v62.66,31.4 62,32.25 62.7,33.75 62.66,35.94 61.59,37.21 JP2.21 | 66.88,20.17 66.8,25.45 66.3,28.75 v66.88,30.69
  Bottom 0.305: v62.66,31.4 65.17,31.39 v66.88,30.69
FR-POT-2  (via drill 0.5)
  Top 0.305: v54.61,30.23 54.61,25.78 53.34,24.51 R12.1 | v63.13,32.47 63.5,33.4 63.5,37.21 JP2.22
  Bottom 0.305: v54.61,30.23 57.15,32.77 v63.13,32.47
GND  (via drill 0.5)
  Top 0.305: v13.97,25.15 13.34,25.78 13.34,31.5 IC2.6 | IC2.13 8.26,23.88 10.79,26.42 10.79,31.5 IC2.7 10.79,32.13 10.79,35.94 | 10.79,35.94 10.79,37.21 JP2.1 | IC5.12 43.18,13.08 v43.18,16.26 43.18,18.16 44.45,19.43 v44.45,21.97 44.45,22.61 43.18,23.88 IC6.12 | v29.21,16.89 29.21,18.8 29.84,18.8 C1.2 | IC3.10 3.17,16.26 3.17,23.24 IC2.11 3.17,23.88 3.17,31.5 IC2.10 3.17,32.13 3.17,32.77 5.08,34.67 5.08,35.94 10.79,35.94 | JP1.1 9.53,2.92 v9.53,10.54 | J1.2 95.89,14.99 95.89,18.16 J1.3 | SV1.4 94.61,14.35 94.61,16.26 SV1.6 94.61,16.89 94.61,18.8 SV1.8 | SV1.3 97.16,14.35 97.16,16.26 SV1.5 97.16,16.89 97.16,18.8 SV1.7 | JP2.30 83.82,37.21 83.82,36.58 87,33.4 88.09,32.16 7L805.GND 87.89,29.53 85.86,27.79 85.86,27.16 81.92,24.51 JP3.1 81.28,24.51 81.28,28.32 81.92,28.32 D5.1 | R9.1 57.15,13.72 60.33,13.72 C9.2 60.96,14.35 62.23,15.62 62.23,21.34 | 62.23,21.34 64.14,21.34 C13.2 64.77,21.34 65.41,21.34 v65.41,19.43 | 62.23,21.34 60.96,21.34 C12.2 60.33,21.34 57.15,21.34 R5.1 | C14.2 81.92,13.08 85.09,13.08 85.09,13.72 C10.+ 85.09,14.35 85.09,19.43 C11.- | SV2.13 77.47,6.73 77.47,8.64 SV2.14 78.11,9.27 78.11,13.72 76.83,14.99 76.83,20.07 IC1.1
  Bottom 0.305: 10.79,30.86 11.43,31.5 13.34,31.5 IC2.6 | 10.79,30.86 6.99,27.05 D3.1 | v13.97,25.15 13.97,26.42 D4.1 | 10.79,30.86 10.79,31.5 IC2.7 | 28.57,16.26 v29.21,16.89 | 28.57,16.26 26.67,16.26 IC3.1 26.04,15.62 24.77,14.35 13.34,14.35 v9.53,10.54 5.71,14.35 5.08,14.35 3.81,15.62 IC3.10 | 28.57,16.26 33.6,16.25 34.8,15.65 38,15.65 38.4,16.35 v43.18,16.26 | JP1.30 84.45,2.29 92.71,10.54 92.71,13.72 93.98,13.72 SV1.4 94.61,13.72 96.52,13.72 SV1.3 | J1.2 95.89,14.99 95.89,16.26 96.52,16.26 SV1.5 | JP2.27 76.83,37.21 78.74,35.31 81.92,35.31 83.82,37.21 JP2.30 | C11.- 85.09,20.07 81.28,23.88 JP3.1 81.28,24.51 80.01,24.51 80.01,21.34 78.11,21.34 77.47,20.7 IC1.1 77.47,20.07 75.56,18.16 66.67,18.16 v65.41,19.43 64.3,20.65 51.63,20.73 51,21.75 48.9,21.97 v44.45,21.97 | SV1.6 93.98,16.26 88.9,16.26 87,14.35 85.72,14.35 C10.+
HI-FREQ  (via drill 0.5)
  Top 0.305: C12.1 60.33,24.51 59.05,25.78 58.85,29.05 58,31.25 58,33.45 57.5,34.15 53.7,34.15 v53,35.35
  Bottom 0.305: v53,35.35 51.9,35.55 50.7,34.85 49.2,36.05 JP2.16
HI-LO-SWITCH  (via drill 0.5)
  Top 0.305: v59.05,14.99 60.33,16.26 C9.1 | v66.86,15.25 64.73,14.95 R11.1 | 75.56,19.43 74.93,20.07 IC1.2 | v75.56,14.99 75.56,19.43 | v74.93,34.67 75.56,34.04 75.56,19.43
  Bottom 0.305: v59.05,14.99 59.69,14.35 v66.86,15.25 71.78,15.25 | 71.78,15.25 71.75,13.08 IC1.6 | v75.56,14.99 74.93,14.35 71.78,15.25 | v74.93,34.67 66.7,34.65 65,34.95 56.41,34.97 53.98,37.21 JP2.18
INTERNAL-CLOCK-NORMALIZE  (via drill 0.5)
  Top 0.305: v73.03,28.96 73.03,21.34 72.39,20.7 IC1.3 | v24.6,34.85 JP2.6
  Bottom 0.305: v73.03,28.96 72.39,29.59 69.68,29.69 68.4,30.75 68.4,32.35 67.3,32.45 66.44,33.64 65.9,33.65 64.8,34.15 54.77,34.34 52.51,32.47 49.7,32.37 48.86,33.3 44.88,33.3 43.85,34.04 38.57,34.04 37.84,34.97 34.92,34.67 25.7,34.75 v24.6,34.85
LATCH
  Top 0.305: IC2.9 5.71,31.5 4.45,30.23 4.45,9.27 3.81,8.64 IC3.11
LO-FREQ  (via drill 0.5)
  Top 0.305: v63.5,25.78 63.5,25.15 64.14,24.51 C13.1 | v52.7,25.78 50.8,27.39 50.7,37.01 JP2.17
  Bottom 0.305: v63.5,25.78 62.23,25.78 60.96,27.05 60.33,27.05 59.05,25.78 v52.7,25.78
N$2
  Top 0.305: SV1.10 94.61,21.97 95.25,21.97 J1.4 | SV1.9 96.52,21.97 95.89,21.97 J1.4 | D2.A 97.16,26.42 95.89,25.15 95.89,22.61 J1.4
N$3
  Top 0.305: C14.1 81.28,16.26 81.28,18.8 JP3.3
N$5  (via drill 0.5)
  Top 0.305: v58.42,23.01 57.15,23.88 R5.2 | v63.06,23.01 66.04,23.01 66.04,25.15 v65.41,25.78 64.14,27.05 63.5,27.05 62.87,27.69 62.87,29.59 64.14,30.86 R1.1 | v68,33.35 68,30.25 67.5,29.75 67,28.75 67.2,28.05 67.5,26.23 v67.94,25.78
  Bottom 0.305: v63.06,23.01 v58.42,23.01 | v65.41,25.78 v67.94,25.78 | IC7.2 74.47,33.18 73.6,33.95 68.7,33.95 v68,33.35
N$8
  Top 0.305: SV1.2 94.61,11.18 95.25,10.54 J1.1 | SV1.1 96.52,11.18 95.89,10.54 J1.1 | D1.C 95.89,6.73 95.89,9.91 J1.1
N$10
  Top 0.305: 90.17,23.88 88.33,26.32 D2.C | 90.17,23.88 90.17,20.07 C11.+ | 90.17,23.88 U$1.P$1
N$11
  Top 0.305: IC2.2 23.5,31.5 22.23,30.23 22.23,16.89 21.59,16.26 IC3.3
N$12
  Top 0.305: D1.A 86.36,6.73 88.9,9.27 U$2.P$1 89.53,9.91 89.53,13.08 90.17,13.72 C10.-
N$13  (via drill 0.5)
  Top 0.305: R13.2 57.15,30.86 58.02,28.99 58.02,27.69 57.78,27.05 57.78,25.78 59.35,24.31 59.35,23.04 59.69,22.61 61.59,22.61 62.23,23.24 v62.23,27.05 62.23,29.59 60.96,30.86 R2.2 | v69.12,26.62 71.72,30.1 71.75,32.13 IC7.3
  Bottom 0.305: v69.12,26.62 67.95,26.95 v62.23,27.05
N$15
  Top 0.305: IC2.3 20.95,31.5 18.41,28.96 18.41,25.78 17.14,24.51 17.14,18.8 18.41,17.53 18.41,16.26 IC3.4
N$16  (via drill 0.5)
  Top 0.305: v12.06,30.23 12.06,18.16 11.43,17.53 11.43,16.26 IC3.7
  Bottom 0.305: v12.06,30.23 17.14,30.23 18.41,31.5 IC2.4
N$17  (via drill 0.5)
  Top 0.305: v14.61,20.7 14.61,24.51 15.24,25.15 15.24,30.86 15.88,31.5 IC2.5
  Bottom 0.305: v14.61,20.7 12.06,18.16 10.79,18.16 8.89,16.26 IC3.8
N$18
  Top 0.305: IC2.17 18.41,23.24 19.68,21.97 19.68,9.91 20.95,8.64 IC3.18
N$19
  Top 0.305: IC2.16 15.88,23.24 16.51,22.61 16.51,18.16 17.14,17.53 17.14,9.91 18.41,8.64 IC3.17
N$20
  Top 0.305: IC2.15 13.34,23.24 12.7,22.61 12.7,17.53 12.06,16.89 12.06,9.27 11.43,8.64 IC3.14
N$21
  Top 0.305: IC2.14 10.79,23.24 9.53,21.97 9.53,11.81 8.26,10.54 8.26,8.64 IC3.13
SAMPLE  (via drill 0.5)
  Top 0.305: v76.73,26.69 76.7,30.45 78.74,30.79 78.74,37.21 JP2.28
  Bottom 0.305: v76.73,26.69 71.39,26.59 71.25,26.52 71.27,26.52 IC7.5
SAMPLE-IN  (via drill 0.5)
  Top 0.305: JP2.10 36.3,34.25 36.3,33.55 34.2,32.95 34.2,30.15 v35.8,28.75 | JP2.29 80.1,31.35 78.5,29.65 v78.1,28.85 | v74.5,28.85 73.8,30.15 72.5,30.15 v70.7,27.25
  Bottom 0.305: v35.8,28.75 38.7,28.55 40.6,29.95 42.5,29.25 48.6,29.25 51.2,26.85 58.7,27.05 60.1,28.05 66,28.05 70.3,27.31 v70.7,27.25 | v78.1,28.85 v74.5,28.85
SAMPLE_CLOCK  (via drill 0.5)
  Top 0.305: 31.75,28.32 30.48,27.05 R10.2 | v31.25,33.54 31.75,28.32 | SV2.9 73.03,6.73 73.03,8.64 SV2.10 71.4,7.75 66.3,7.75 v66.3,11.45 | 31.75,28.32 31.7,29.35 33.8,29.35 35.2,27.65 36.6,26.15 36.6,18.75 37.7,18.35 v39.1,18.55
  Bottom 0.305: IC2.8 8.26,31.5 5.71,28.96 D3.3 5.08,28.96 4.45,28.96 4.45,32.77 6.42,34.54 22.7,34.35 24.8,33.95 30.4,34.04 v31.25,33.54 | v66.3,11.45 55.7,11.75 53.3,13.75 48.9,14.85 48.1,16.25 45.4,16.25 43.5,17.55 v39.1,18.55
UNI  (via drill 0.5)
  Top 0.305: v60.96,25.78 60.96,28.32 R2.1 60.33,28.96 59.05,30.23 59.05,35.31 v59.99,35.94 | v67.94,24.51 67.94,23.88 69.22,22.61 71.75,22.61 71.75,24.51 IC7.6 | v65.37,35.74 65.97,35.31 66.67,35.31 68.58,37.21 JP2.24
  Bottom 0.305: v60.96,25.78 62.23,24.51 v67.94,24.51 | IC7.7 74.3,25.15 72.39,25.15 IC7.6 | v65.37,35.74 64.23,35.61 60.92,35.61 v59.99,35.94
UNI-BI-SWITCH  (via drill 0.5)
  Top 0.305: v54.61,31.5 53.34,31.5 R3.1 | v68.14,28.62 70.48,30.86 70.48,35.31 71.12,35.94 71.12,37.21 JP2.25
  Bottom 0.305: v54.61,31.5 53.34,30.23 53.34,28.96 56.6,29.05 58.5,28.65 60.6,28.75 65.44,28.76 66.38,28.72 v68.14,28.62
VDD  (via drill 0.5)
  Top 0.305: IC5.3 42.55,20.7 42.55,21.97 41.91,22.61 41.91,28.32 43.18,29.59 43.18,31.5 IC6.3 | SV2.15 80.64,6.73 80.64,8.64 SV2.16 80.01,9.27 78.74,10.54 v78.74,15.62 78.74,21.34 76.83,23.24 76.83,24.51 IC7.8
  Bottom 0.305: 85.09,26.42 85.09,24.51 U$1.P$2 | 85.09,26.42 85.09,28.96 7L805.IN | 85.09,26.42 78.74,26.42 77.47,25.15 IC7.8 | v78.74,15.62 78.11,16.26 54.61,16.26 52.67,17.49 47.52,17.49 46.35,18.16 45.09,18.16 43.18,20.07 IC5.3
VIN  (via drill 0.5)
  Top 0.305: v51.97,34.31 51.44,33.47 51.44,30.23 52.7,28.96 R3.2 | v39.71,35.94 39.7,34.04 39.7,33.4 39.37,32.77 39.37,30.23 v38.73,29.59 | v27.94,29.59 26.04,31.5 IC2.1
  Bottom 0.305: D4.3 13.34,28.96 13.97,29.59 24.13,29.59 26.04,31.5 IC2.1 | v51.97,34.31 50.3,33.95 49.6,34.65 45.5,34.65 44.5,35.35 40.74,35.31 v39.71,35.94 | v27.94,29.59 v38.73,29.59
VREF  (via drill 0.5)
  Top 0.305: R9.2 56.52,16.26 55.24,16.26 53.34,14.35 R8.1 52.7,13.72 52.07,13.08 v52.07,11.18 | 34.92,20.07 34.92,14.99 33.02,13.08 IC5.8 | 34.92,20.07 IC5.6 | 37.47,27.05 37.47,24.51 IC6.10 38.1,23.88 38.1,22.61 40.01,20.7 IC5.4 | 37.47,27.05 37.47,29.59 35.56,31.5 IC6.6 | 37.47,27.05 40.01,29.59 40.01,31.5 IC6.4 | 34.92,20.07 IC6.8
  Bottom 0.305: IC5.8 33.02,12.45 34.92,10.54 35.56,10.54 37.47,12.45 IC5.10 38.1,13.08 40.2,15.39 44.58,15.29 45.91,15.42 46.92,15.42 47.62,14.35 46.99,13.72 46.99,11.18 47.62,10.54 51.44,10.54 v52.07,11.18 | IC5.6 IC6.10
VSS  (via drill 0.5)
  Top 0.305: SV2.12 75.56,8.64 75.56,6.73 SV2.11 75.56,6.1 76.83,4.83 83.82,4.83 83.82,9.27 U$2.P$2 84.45,9.91 87,12.45 87,24.51 86.36,25.15 86.86,27.69 90.47,30.29 v88.27,33.4
  Bottom 0.305: v88.27,33.4 85.09,33.4 81.92,30.23 71.75,30.23 69.85,32.13 IC7.4

### Text on the board
tPlace: TLC3704 | TL072 | CL | CH | TLC3704 | 555 | CC-AT-SA 2015 | OPEN HARDWARE
tNames: Designed by Eli Pechman | 7L805 | 23A: VERT | Rev 1 | 1N4001 | ADC0820 | Bead | +12V | GND | -12V | NO POWER | Bead | www.mysticcircuits.com | EXPANSION | PORT | 1N4001